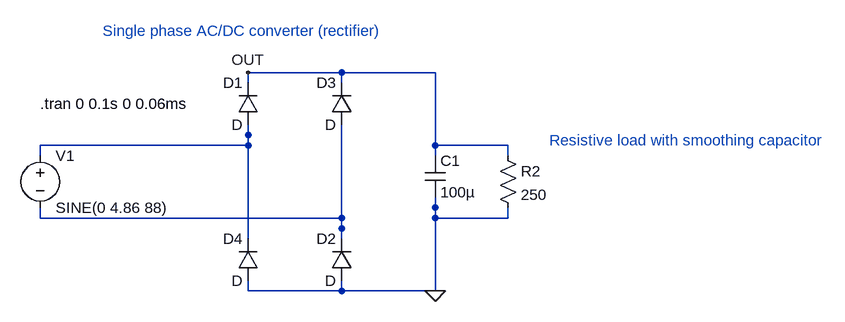
[diagram p0: schematic Single-phase-rectifier-R-load-smoothing-capacitor.asc]
Single-phase-rectifier-R-load-smoothing-capacitor.asc, the LTspice schematic file:
Version 4.1
SHEET 1 1240 680
WIRE 608 368 608 384
WIRE 464 496 464 512
WIRE 320 496 320 512
WIRE 720 384 720 400
WIRE 608 384 608 400
WIRE 608 400 720 400
WIRE 608 384 608 512
WIRE 608 512 464 512
WIRE 464 512 320 512
FLAG 608 512 0
WIRE 320 256 320 272
WIRE 320 432 320 416
WIRE 0 304 0 288
WIRE 320 272 320 416
WIRE 320 272 320 288
WIRE 320 288 0 288
WIRE 464 432 464 416
WIRE 464 256 464 272
WIRE 0 384 0 400
WIRE 464 416 464 272
WIRE 464 416 464 400
WIRE 464 400 0 400
WIRE 608 304 608 288
WIRE 320 192 320 176
WIRE 464 192 464 176
WIRE 720 304 720 288
WIRE 608 288 720 288
WIRE 608 288 608 176
WIRE 608 176 464 176
WIRE 464 176 320 176
FLAG 320 176 OUT
SYMBOL voltage 0 288 R0
WINDOW 123 0 0 Left 2
WINDOW 39 0 0 Left 2
SYMATTR InstName V1
SYMATTR Value SINE(0 4.86 88)
SYMBOL res 704 288 R0
SYMATTR InstName R2
SYMATTR Value 250
SYMBOL cap 592 304 R0
SYMATTR InstName C1
SYMATTR Value 100µ
SYMBOL diode 336 256 R180
WINDOW 0 24 64 Left 2
WINDOW 3 24 0 Left 2
SYMATTR InstName D1
SYMBOL diode 480 496 R180
WINDOW 0 24 64 Left 2
WINDOW 3 24 0 Left 2
SYMATTR InstName D2
SYMBOL diode 480 256 R180
WINDOW 0 24 64 Left 2
WINDOW 3 24 0 Left 2
SYMATTR InstName D3
SYMBOL diode 336 496 R180
WINDOW 0 24 64 Left 2
WINDOW 3 24 0 Left 2
SYMATTR InstName D4
TEXT 0 224 Left 2 !.tran 0 0.1s 0 0.06ms
TEXT 96 112 Left 2 ;Single phase AC/DC converter (rectifier)
TEXT 784 280 Left 2 ;Resistive load with smoothing capacitor

The netlist it stands for:
* Single-phase-rectifier-R-load-smoothing-capacitor.asc
V1 N001 N002 SINE(0 4.86 88)
R2 OUT 0 250
C1 OUT 0 100µ
D1 N001 OUT D
D2 0 N002 D
D3 N002 OUT D
D4 0 N001 D
.model D D
.lib standard.dio
.tran 0 0.1s 0 0.06ms
* Single phase AC/DC converter (rectifier)
* Resistive load with smoothing capacitor
.backanno
.end